# EAGLE schematic main_pa1 (EAGLE 4.11)
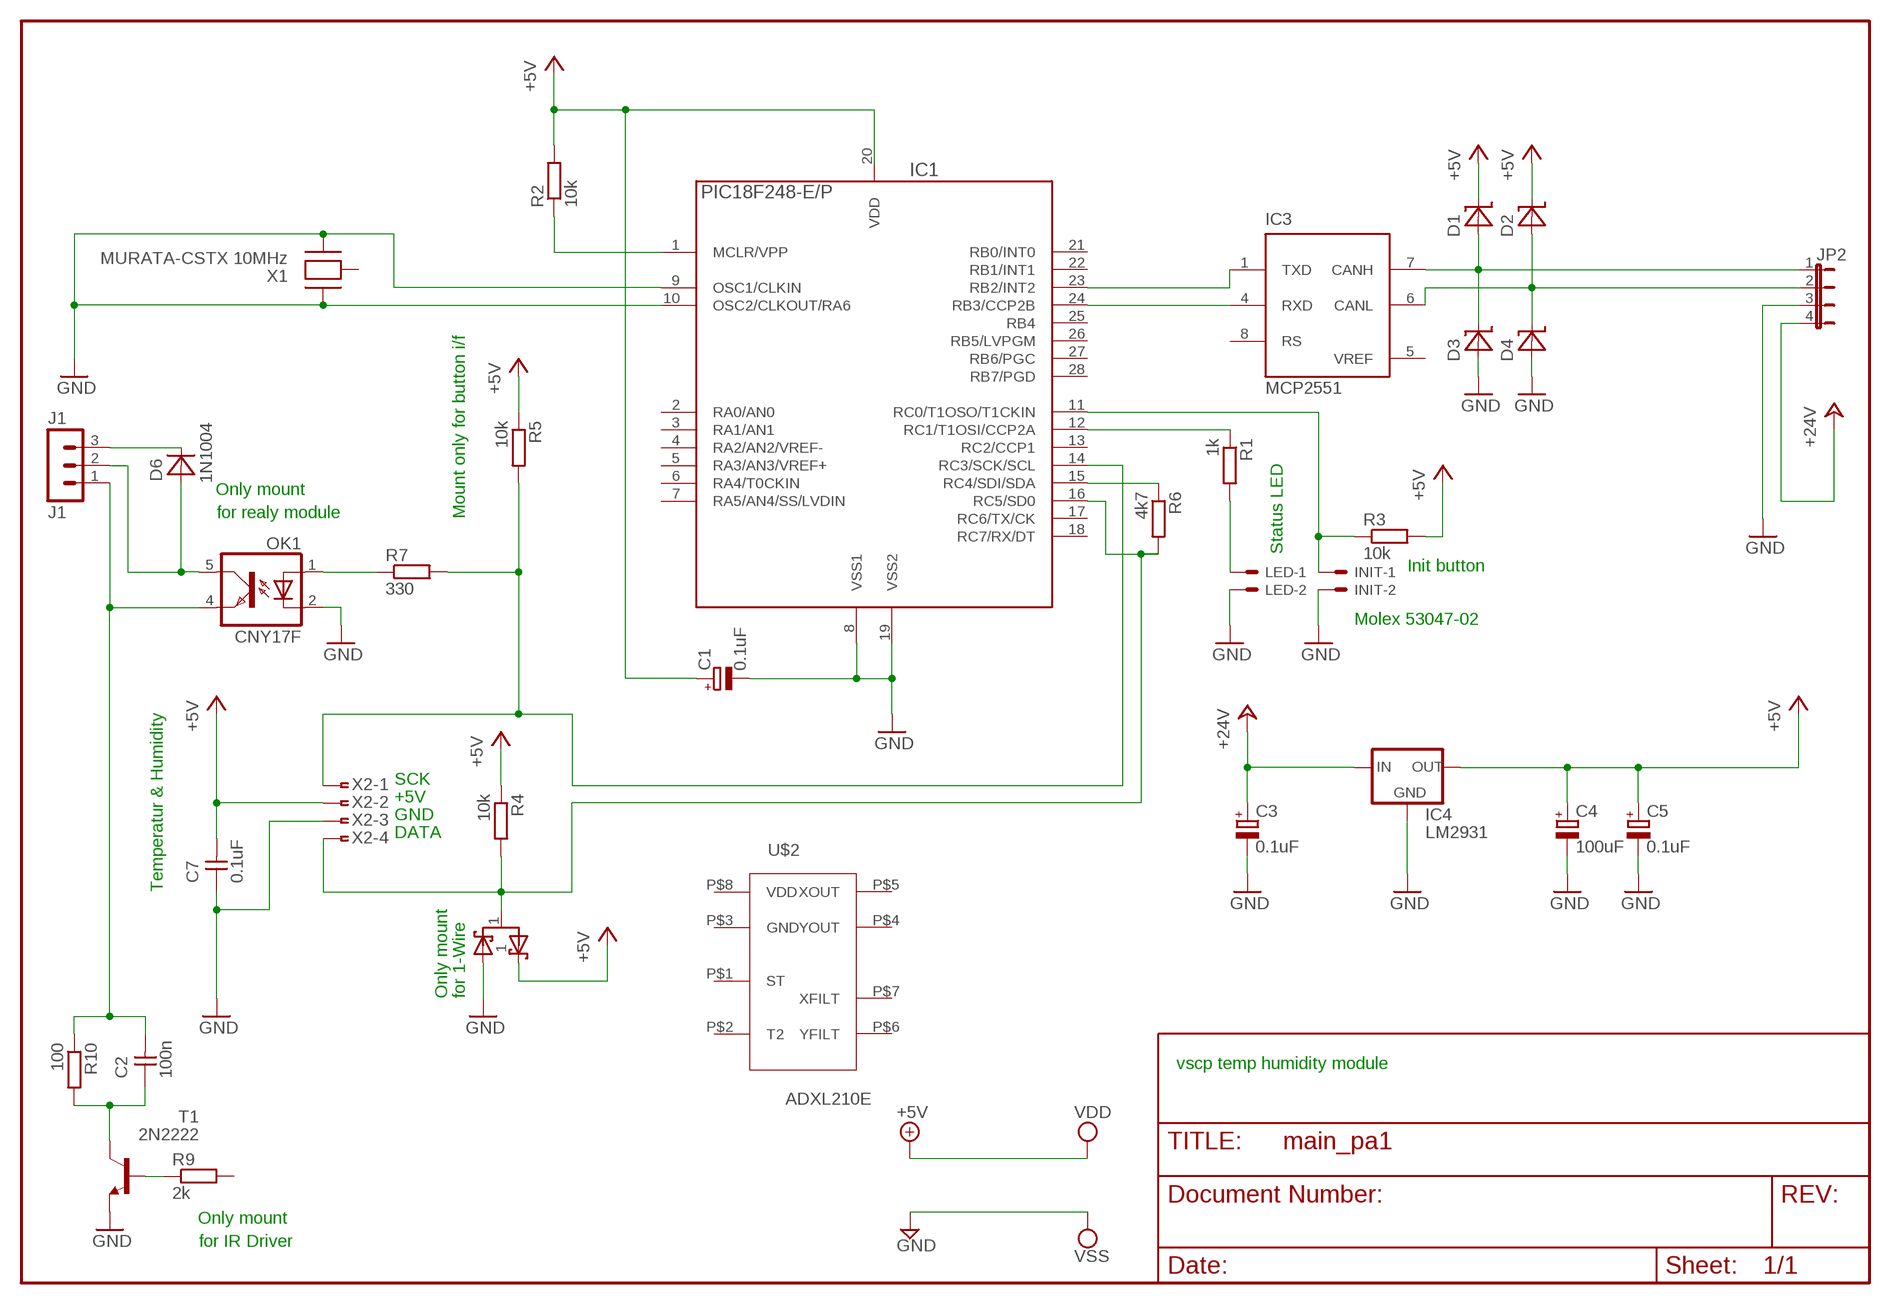
[diagram p0: schematic, sheet 1]

## Parts
C1  0.1uF  CPOL-EUCT3216  [CT3216]
C2  100n  CAPNP-2,5  [C-2,5]
C3  0.1uF  CPOL-EUCT3216  [CT3216]
C4  100uF  CPOL-EUCT7343  [CT7343]
C5  0.1uF  CPOL-EUCT3216  [CT3216]
C7  0.1uF  CAPNP-2,5  [C-2,5]
D1  ZDIO-2,5  [D-2,5]
D2  ZDIO-2,5  [D-2,5]
D3  ZDIO-2,5  [D-2,5]
D4  ZDIO-2,5  [D-2,5]
D5  BAT54SCT  [SOT23]
D6  1N1004  DIODE-7,5  [D-7,5]
IC1  PIC18F248-E/P  PIC18F252-E/P  [PDIP-28]
IC3  MCP2551  MCP2551SN  [SO-08]
IC4  LM2931  78LXX  [78LXX]
INIT  53047-02  [53047-02]
J1  J1  MA03-1  [MA03-1]
JP2  JP4E  [JP4]
LED  53047-02  [53047-02]
OK1  CNY17F  [DIL06]
R1  1k  R-EU_R0805  [R0805]
R2  10k  R-EU_R0805  [R0805]
R3  10k  R-EU_R0805  [R0805]
R4  10k  R-EU_R0805  [R0805]
R5  10k  R-EU_R0805  [R0805]
R6  4k7  R-EU_R0805  [R0805]
R7  330  R-EU_R0805  [R0805]
R9  2k  R-EU_R0805  [R0805]
R10  100  R-EU_R0805  [R0805]
T1  2N2222  [TO18]
U$2  ADXL210E  [TSOC8]
X1  MURATA-CSTX 10MHz  MURATA-CSTX  [RESONATOR-MURATA]
X2  FTOP-4  [FTOP-4]

## Nets
+5V: C1.+ C4.+ C5.+ C7.2 D1.2(K) D2.2(K) D5.2 IC4.OUT R2.2 R3.2 R4.1 R5.1 X2.2
+24V: C3.+ IC4.IN JP2.4
CANH: D1.1(A) D3.2(K) IC3.7(CANH) JP2.1
CANL: D2.1(A) D4.2(K) IC3.6(CANL) JP2.2
GND: C1.- C3.- C4.- C5.- C7.1 D3.1(A) D4.1(A) D5.3 IC1.8(VSS1) IC1.9(OSC1/CLKIN) IC1.10(OSC2/CLKOUT/RA6) IC1.19(VSS2) IC4.GND INIT.2 JP2.3 LED.2 OK1.2(C) T1.1(E) X1.1(XTIN) X1.3(XTOUT) X2.3
GP0: IC1.14(RC3/SCK/SCL) R5.2 R7.2 X2.1
GP1: D5.1 IC1.16(RC5/SD0) R4.2 R6.2 X2.4
N$2: IC1.12(RC1/T1OSI/CCP2A) R1.1
N$3: R2.1
N$4: IC1.24(RB3/CCP2B) IC3.4(RXD)
N$5: LED.1 R1.2
N$6: IC1.11(RC0/T1OSO/T1CKIN) INIT.1 R3.1
N$7: IC1.15(RC4/SDI/SDA) R6.1
N$8: OK1.1(A) R7.1
N$9: D6.2(K) J1.3
N$11: D6.1(A) J1.2 OK1.5(COL)
N$12: R9.1 T1.2(B)
N$13: C2.1 R10.2 T1.3(C)
N$14: C2.2 J1.1 OK1.4(EMIT) R10.1
TXCAN: IC1.23(RB2/INT2) IC3.1(TXD)
Unconnected: IC1.1(MCLR/VPP) IC1.2(RA0/AN0) IC1.3(RA1/AN1) IC1.4(RA2/AN2/VREF-) IC1.5(RA3/AN3/VREF+) IC1.6(RA4/T0CKIN) IC1.7(RA5/AN4/SS/LVDIN) IC1.13(RC2/CCP1) IC1.17(RC6/TX/CK) IC1.18(RC7/RX/DT) IC1.21(RB0/INT0) IC1.22(RB1/INT1) IC1.25(RB4) IC1.26(RB5/LVPGM) IC1.27(RB6/PGC) IC1.28(RB7/PGD) IC3.8(RS) R9.2 U$2.P$1(ST) U$2.P$2(T2) U$2.P$4(YOUT) U$2.P$5(XOUT) U$2.P$6(YFILT) U$2.P$7(XFILT)

## Notes on the sheet
- Only mount
- for realy module | Mount only for button i/f
- Status LED
- Init button
- Molex 53047-02
- SCK
- +5V
- GND
- DATA
- Temperatur & Humidity
- Only mount | for 1-Wire
- vscp temp humidity module
- Only mount
- for IR Driver

## Power pins joined to a net without a drawn wire
GND: U$2.P$3(GND) X1.2(GND)
VDD: IC1.20(VDD) IC3.3(VDD) U$2.P$8(VDD)
VREF: IC3.5(VREF)
VSS: IC3.2(VSS)

## Library data of the parts
C1 C3-C5 = rcl:CPOL-EU: POLARIZED CAPACITOR, European symbol
C2 C7 = discrete:CAPNP-2,5
D1-D4 = discrete:ZDIO-2,5
D5 = dallas:BAT54S
D6 = discrete:DIODE-7,5
IC1 = pic18:PIC18*F252-?: 18F252, 28 pin, 32Kb prog, 1536 data, 256 EEPROM
IC3 = microchip_can:MCP2551: High Speed CAN tranceiver
IC4 = v-reg:78LXX: VOLTAGE REGULATOR
INIT LED = con-molex:53?-02: CONNECTOR wire to board 1.25 mm (.049 inch) pitch header
J1 = con-lstb:MA03-1: PIN HEADER
JP2 = jumper:JP4E: JUMPER
OK1 = optocoupler:CNY17F: SIEMENS OPTO COUPLER
R1-R7 R9 R10 = rcl:R-EU_: RESISTOR, European symbol
T1 = transistor:2N2222: NPN TRANSISTOR
U$2 = eurosource_dallas:ADXL210E
X1 = eurosource_ftdi:MURATA-CSTX
X2 = con-amp:FTOP-4: AMP connector